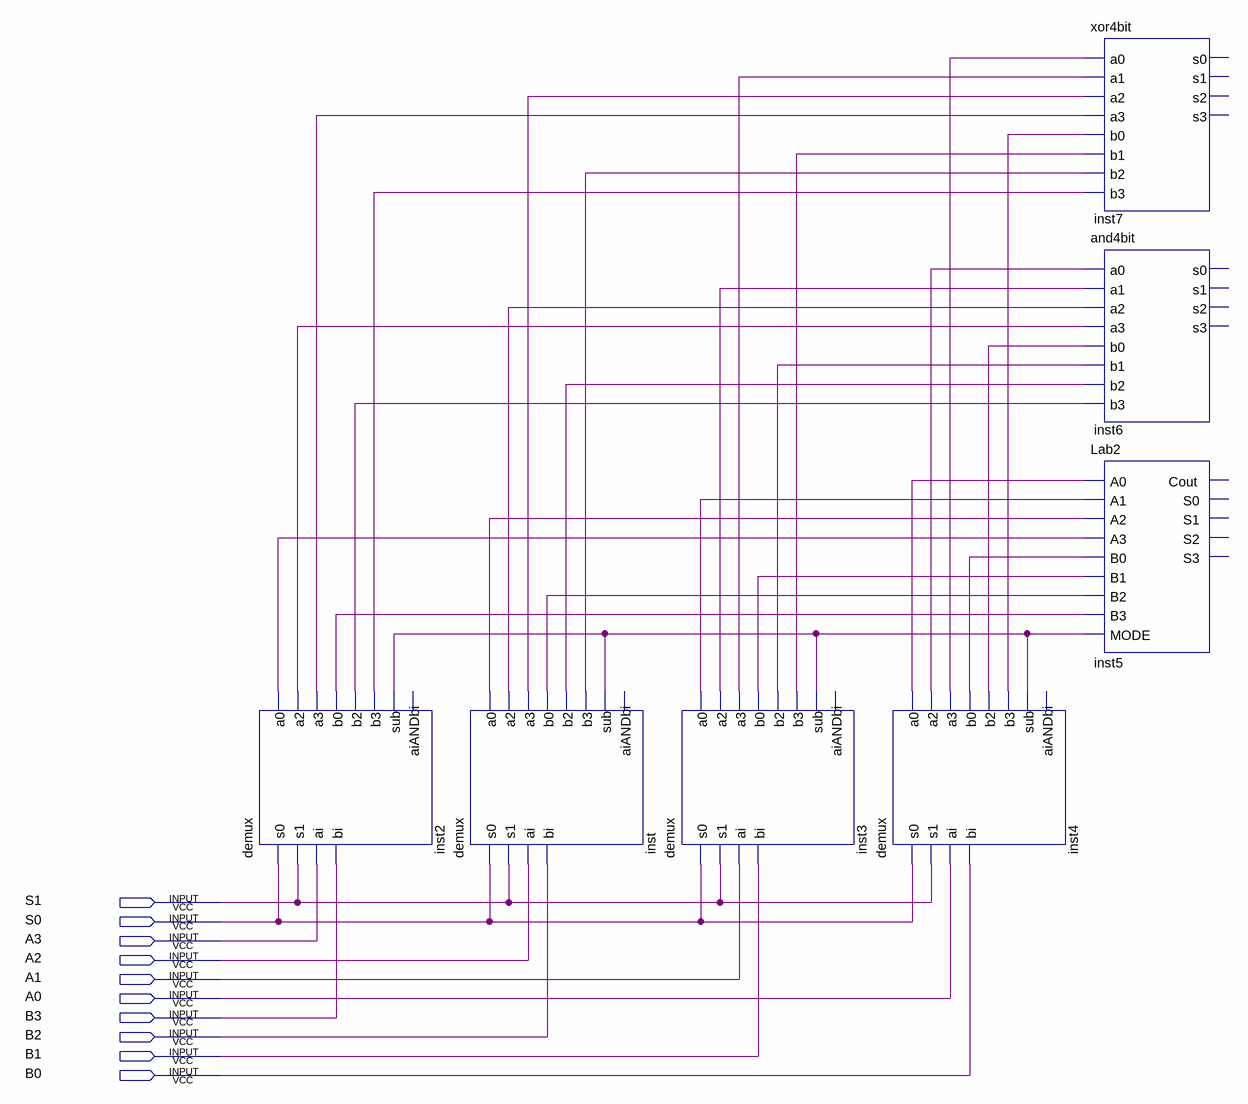
[diagram p0: schematic sheet]
// Quartus schematic Block1.bdf as structural Verilog: 7 symbols, 10 pins
module Block1 (
  input  S1,
  input  S0,
  input  A3,
  input  A2,
  input  A1,
  input  A0,
  input  B3,
  input  B2,
  input  B1,
  input  B0
);

  wire inst2_a0, inst2_a2, inst2_a3, inst2_b0, inst2_b2, inst2_b3, inst2_sub, inst3_a0, inst3_a2, inst3_a3,
       inst3_b0, inst3_b2, inst3_b3, inst4_a0, inst4_a2, inst4_a3, inst4_b0, inst4_b2, inst4_b3, inst_a0,
       inst_a2, inst_a3, inst_b0, inst_b2, inst_b3;

  demux inst2 (
    .s0(S0), .s1(S1), .ai(A3), .bi(B3), .a0(inst2_a0), .a2(inst2_a2), .a3(inst2_a3), .b0(inst2_b0),
    .b2(inst2_b2), .b3(inst2_b3), .sub(inst2_sub));  // open: aiANDbi
  demux inst (
    .s0(S0), .s1(S1), .ai(A2), .bi(B2), .a0(inst_a0), .a2(inst_a2), .a3(inst_a3), .b0(inst_b0), .b2(inst_b2),
    .b3(inst_b3), .sub(inst2_sub));  // open: aiANDbi
  demux inst3 (
    .s0(S0), .s1(S1), .ai(A1), .bi(B1), .a0(inst3_a0), .a2(inst3_a2), .a3(inst3_a3), .b0(inst3_b0),
    .b2(inst3_b2), .b3(inst3_b3), .sub(inst2_sub));  // open: aiANDbi
  demux inst4 (
    .s0(S0), .s1(S1), .ai(A0), .bi(B0), .a0(inst4_a0), .a2(inst4_a2), .a3(inst4_a3), .b0(inst4_b0),
    .b2(inst4_b2), .b3(inst4_b3), .sub(inst2_sub));  // open: aiANDbi
  xor4bit inst7 (
    .a0(inst4_a3), .a1(inst3_a3), .a2(inst_a3), .a3(inst2_a3), .b0(inst4_b3), .b1(inst3_b3), .b2(inst_b3),
    .b3(inst2_b3));  // open: s0, s1, s2, s3
  and4bit inst6 (
    .a0(inst4_a2), .a1(inst3_a2), .a2(inst_a2), .a3(inst2_a2), .b0(inst4_b2), .b1(inst3_b2), .b2(inst_b2),
    .b3(inst2_b2));  // open: s0, s1, s2, s3
  Lab2 inst5 (
    .A0(inst4_a0), .A1(inst3_a0), .A2(inst_a0), .A3(inst2_a0), .B0(inst4_b0), .B1(inst3_b0), .B2(inst_b0),
    .B3(inst2_b0), .MODE(inst2_sub));  // open: Cout, S0, S1, S2, S3
endmodule
